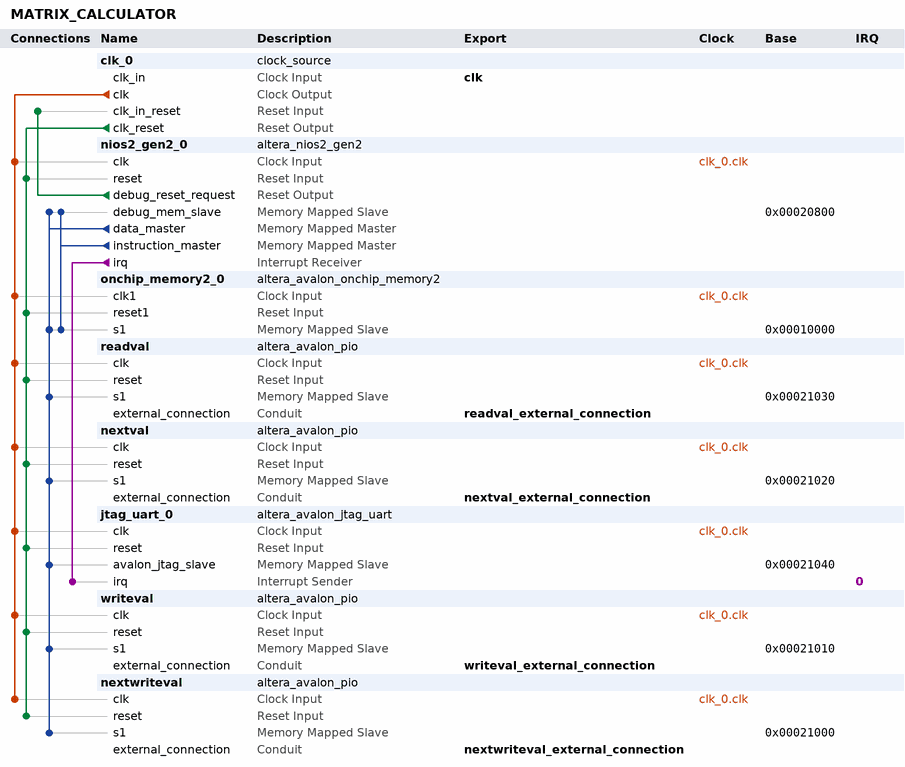
[diagram p0: system contents]
# Platform Designer (Qsys) system MATRIX_CALCULATOR, Cyclone V 5CSEMA5F31C6
# Parameters at their usual value, and those the tool derives, are not listed.
package require -exact qsys 18.1
create_system MATRIX_CALCULATOR
set_project_property DEVICE_FAMILY {Cyclone V}
set_project_property DEVICE 5CSEMA5F31C6

add_instance clk_0 clock_source 18.1
set_instance_parameter_value clk_0 clockFrequency 50000000

add_instance nios2_gen2_0 altera_nios2_gen2 18.1
set_instance_parameter_value nios2_gen2_0 dcache_size 2048
set_instance_parameter_value nios2_gen2_0 exceptionSlave onchip_memory2_0.s1
set_instance_parameter_value nios2_gen2_0 icache_size 4096
set_instance_parameter_value nios2_gen2_0 impl Tiny
set_instance_parameter_value nios2_gen2_0 resetSlave onchip_memory2_0.s1

add_instance onchip_memory2_0 altera_avalon_onchip_memory2 18.1
set_instance_parameter_value onchip_memory2_0 dataWidth 32
set_instance_parameter_value onchip_memory2_0 dualPort false
set_instance_parameter_value onchip_memory2_0 initMemContent true
set_instance_parameter_value onchip_memory2_0 initializationFileName onchip_mem.hex
set_instance_parameter_value onchip_memory2_0 memorySize 40096

add_instance readval altera_avalon_pio 18.1
set_instance_parameter_value readval direction Input
set_instance_parameter_value readval width 8

add_instance nextval altera_avalon_pio 18.1
set_instance_parameter_value nextval direction Output
set_instance_parameter_value nextval width 8

add_instance jtag_uart_0 altera_avalon_jtag_uart 18.1
set_instance_parameter_value jtag_uart_0 simInteractiveOptions NO_INTERACTIVE_WINDOWS

add_instance writeval altera_avalon_pio 18.1
set_instance_parameter_value writeval direction Output
set_instance_parameter_value writeval width 8

add_instance nextwriteval altera_avalon_pio 18.1
set_instance_parameter_value nextwriteval direction Output
set_instance_parameter_value nextwriteval width 8

# connections
add_connection clk_0.clk jtag_uart_0.clk clock
add_connection clk_0.clk nextval.clk clock
add_connection clk_0.clk nextwriteval.clk clock
add_connection clk_0.clk nios2_gen2_0.clk clock
add_connection clk_0.clk onchip_memory2_0.clk1 clock
add_connection clk_0.clk readval.clk clock
add_connection clk_0.clk writeval.clk clock
add_connection clk_0.clk_reset jtag_uart_0.reset reset
add_connection clk_0.clk_reset nextval.reset reset
add_connection clk_0.clk_reset nextwriteval.reset reset
add_connection clk_0.clk_reset nios2_gen2_0.reset reset
add_connection clk_0.clk_reset onchip_memory2_0.reset1 reset
add_connection clk_0.clk_reset readval.reset reset
add_connection clk_0.clk_reset writeval.reset reset
add_connection nios2_gen2_0.debug_reset_request clk_0.clk_in_reset reset
add_connection nios2_gen2_0.data_master jtag_uart_0.avalon_jtag_slave avalon
set_connection_parameter_value nios2_gen2_0.data_master/jtag_uart_0.avalon_jtag_slave baseAddress 0x00021040
add_connection nios2_gen2_0.data_master nextval.s1 avalon
set_connection_parameter_value nios2_gen2_0.data_master/nextval.s1 baseAddress 0x00021020
add_connection nios2_gen2_0.data_master nextwriteval.s1 avalon
set_connection_parameter_value nios2_gen2_0.data_master/nextwriteval.s1 baseAddress 0x00021000
add_connection nios2_gen2_0.data_master nios2_gen2_0.debug_mem_slave avalon
set_connection_parameter_value nios2_gen2_0.data_master/nios2_gen2_0.debug_mem_slave baseAddress 0x00020800
add_connection nios2_gen2_0.data_master onchip_memory2_0.s1 avalon
set_connection_parameter_value nios2_gen2_0.data_master/onchip_memory2_0.s1 baseAddress 0x00010000
add_connection nios2_gen2_0.data_master readval.s1 avalon
set_connection_parameter_value nios2_gen2_0.data_master/readval.s1 baseAddress 0x00021030
add_connection nios2_gen2_0.data_master writeval.s1 avalon
set_connection_parameter_value nios2_gen2_0.data_master/writeval.s1 baseAddress 0x00021010
add_connection nios2_gen2_0.instruction_master nios2_gen2_0.debug_mem_slave avalon
set_connection_parameter_value nios2_gen2_0.instruction_master/nios2_gen2_0.debug_mem_slave baseAddress 0x00020800
add_connection nios2_gen2_0.instruction_master onchip_memory2_0.s1 avalon
set_connection_parameter_value nios2_gen2_0.instruction_master/onchip_memory2_0.s1 baseAddress 0x00010000
add_connection nios2_gen2_0.irq jtag_uart_0.irq interrupt
set_connection_parameter_value nios2_gen2_0.irq/jtag_uart_0.irq irqNumber 0

# exported interfaces
add_interface clk clock sink
set_interface_property clk EXPORT_OF clk_0.clk_in
add_interface nextval_external_connection conduit end
set_interface_property nextval_external_connection EXPORT_OF nextval.external_connection
add_interface nextwriteval_external_connection conduit end
set_interface_property nextwriteval_external_connection EXPORT_OF nextwriteval.external_connection
add_interface readval_external_connection conduit end
set_interface_property readval_external_connection EXPORT_OF readval.external_connection
add_interface writeval_external_connection conduit end
set_interface_property writeval_external_connection EXPORT_OF writeval.external_connection

set_interconnect_requirement {$system} qsys_mm.clockCrossingAdapter HANDSHAKE
set_interconnect_requirement {$system} qsys_mm.enableEccProtection FALSE
set_interconnect_requirement {$system} qsys_mm.insertDefaultSlave FALSE
set_interconnect_requirement {$system} qsys_mm.maxAdditionalLatency 1

save_system MATRIX_CALCULATOR.qsys
